# Altium schematic sheet main.SchDoc
size A2
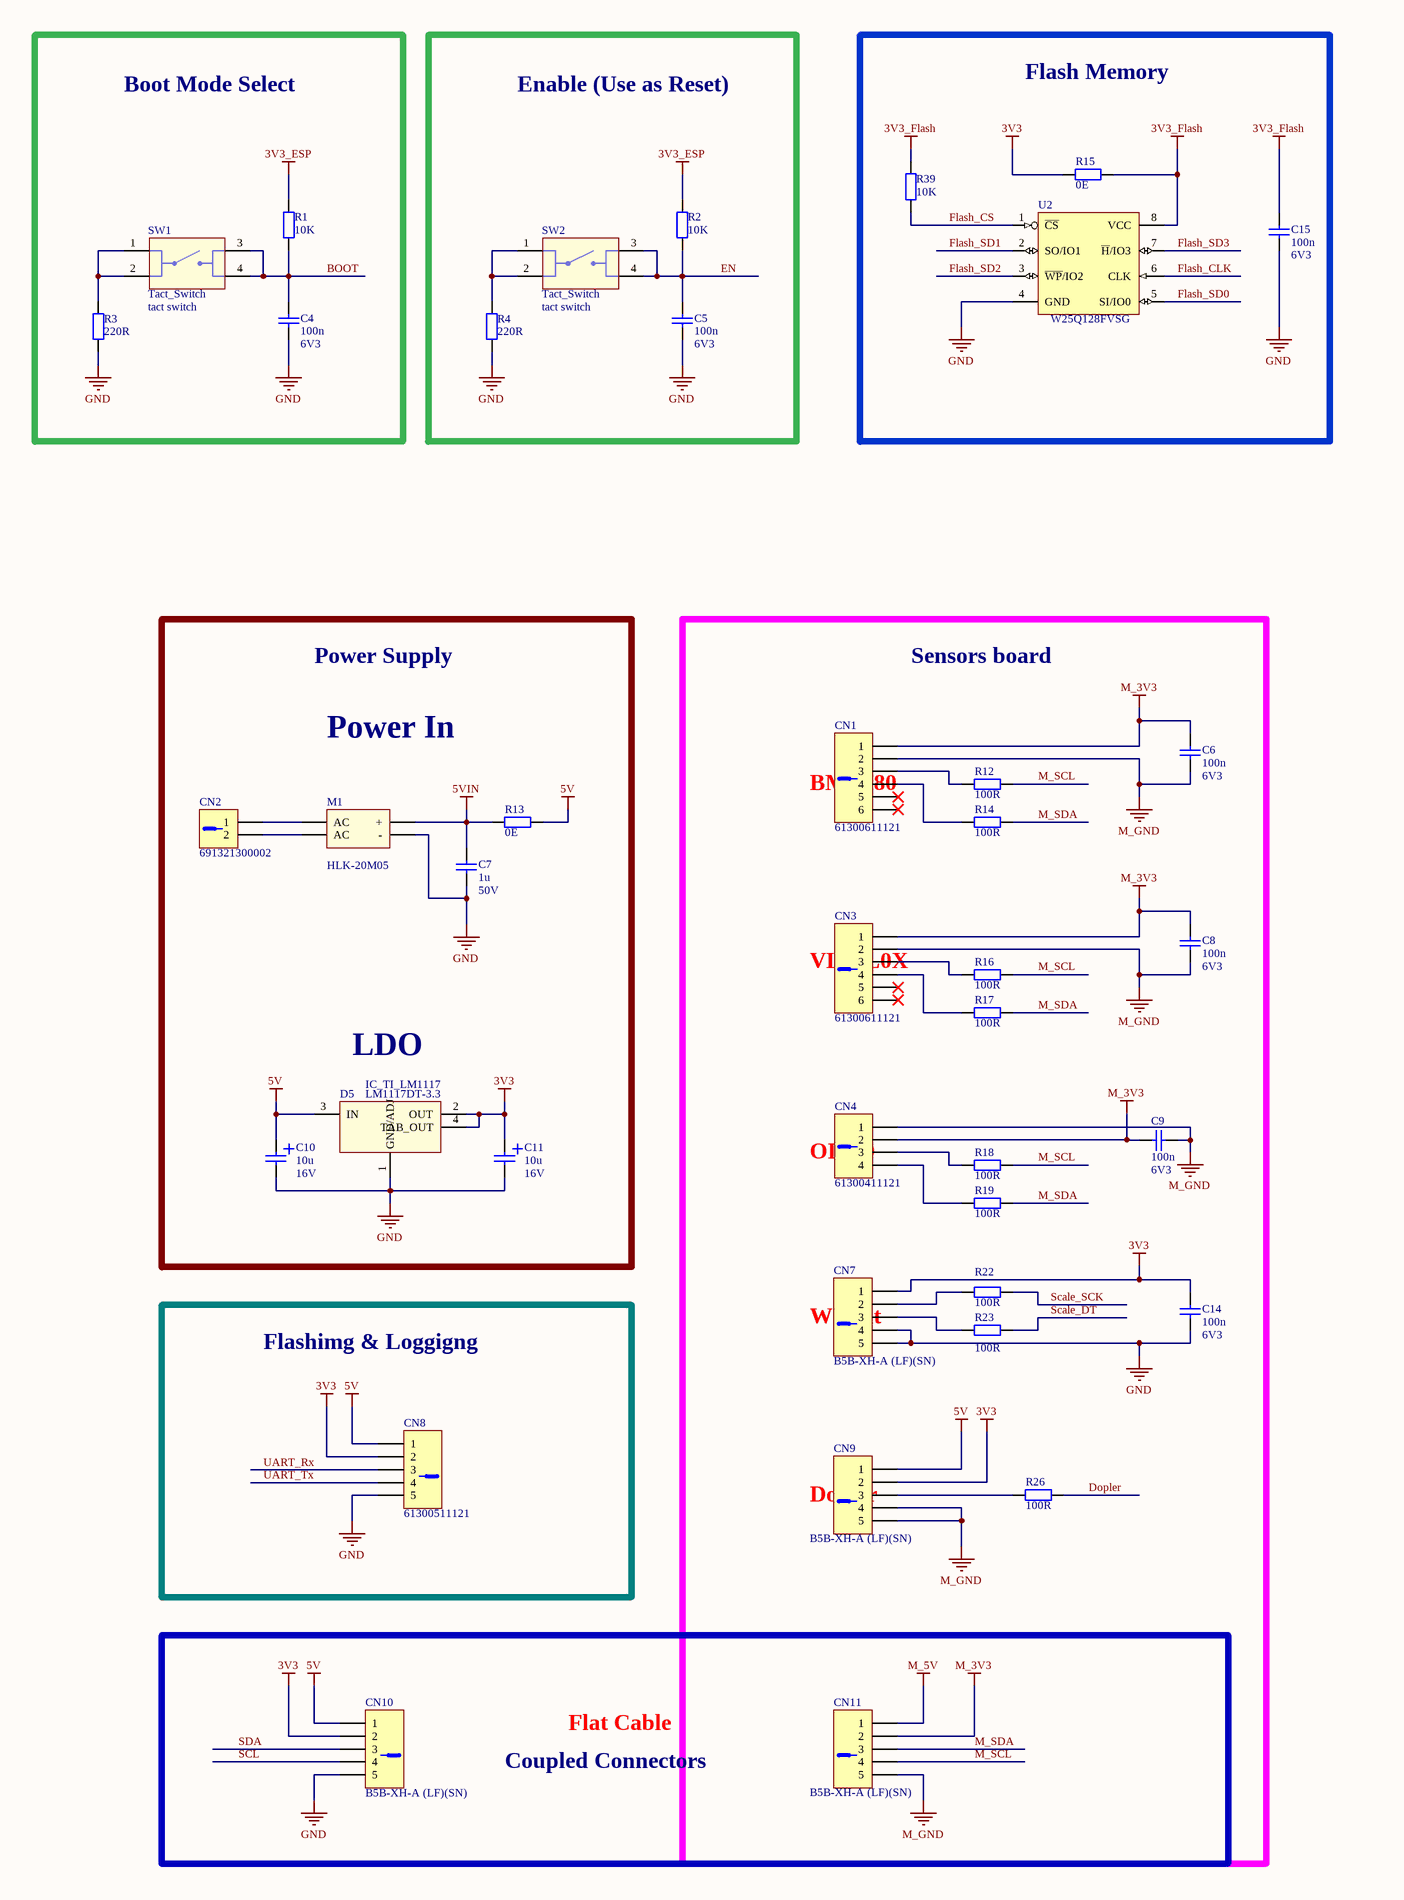
[diagram p0: main.SchDoc, left]
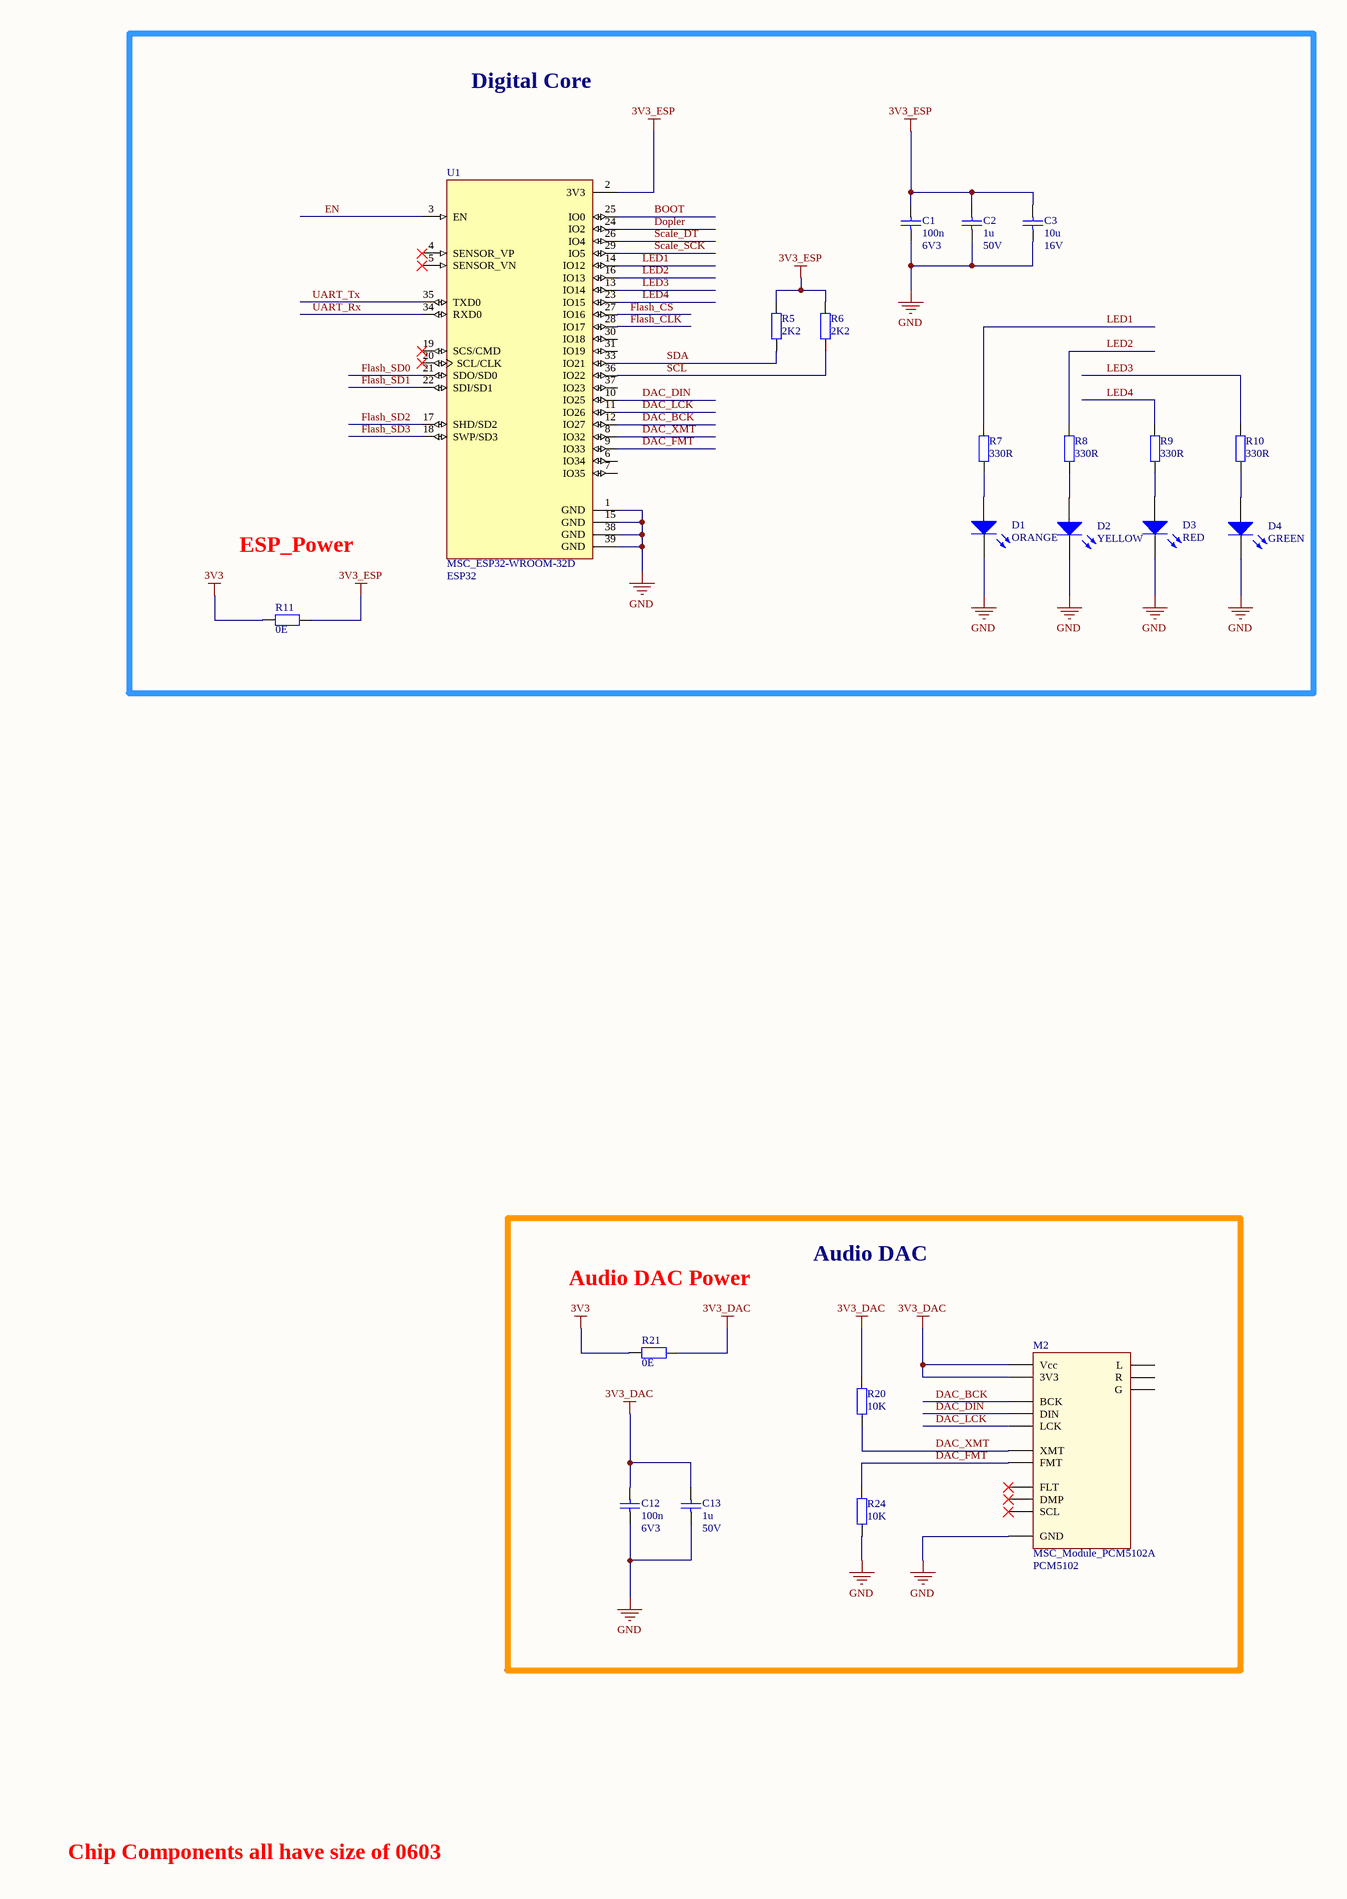
[diagram p1: main.SchDoc, right]

## Parts
C1  Value1: 100n  Value2: 6V3  [CAPC0603X31N]  (hidden comment: CAP)
C2  Value1: 1u  Value2: 50V  [CAPC2012X125N]  (hidden comment: CAP)
C3  Value1: 10u  Value2: 16V  [CAPC2012X145N]  (hidden comment: CAP)
C4  Value1: 100n  Value2: 6V3  [CAPC0603X31N]  (hidden comment: CAP)
C5  Value1: 100n  Value2: 6V3  [CAPC0603X31N]  (hidden comment: CAP)
C6  Value1: 100n  Value2: 6V3  [CAPC0603X31N]  (hidden comment: CAP)
C7  Value1: 1u  Value2: 50V  [CAPC2012X125N]  (hidden comment: CAP)
C8  Value1: 100n  Value2: 6V3  [CAPC0603X31N]  (hidden comment: CAP)
C9  Value1: 100n  Value2: 6V3  [CAPC0603X31N]  (hidden comment: CAP)
C10  Value1: 10u  Value2: 16V  [CAPAE430X550N]  (hidden comment: CAP_POL)
C11  Value1: 10u  Value2: 16V  [CAPAE430X550N]  (hidden comment: CAP_POL)
C12  Value1: 100n  Value2: 6V3  [CAPC0603X31N]  (hidden comment: CAP)
C13  Value1: 1u  Value2: 50V  [CAPC2012X125N]  (hidden comment: CAP)
C14  Value1: 100n  Value2: 6V3  [CAPC0603X31N]  (hidden comment: CAP)
C15  Value1: 100n  Value2: 6V3  [CAPC0603X31N]  (hidden comment: CAP)
CN1  Value1: 61300611121  [CN_WURTH_61300611121]  (hidden comment: CN_1X6M)
CN2  Value1: 691321300002  [CN_WURTH_691321300002]  (hidden comment: CN_1X2M)
CN3  Value1: 61300611121  [CN_WURTH_61300611121]  (hidden comment: CN_1X6M)
CN4  Value1: 61300411121  [CN_WURTH_61300411121]  (hidden comment: CN_1X4M)
CN7  Value1: B5B-XH-A (LF)(SN)  [CN_JST_B5B-XH-A]  (hidden comment: CN_1X5M)
CN8  Value1: 61300511121  [CN_Wurth_61300511121]  (hidden comment: CN_1X5M)
CN9  Value1: B5B-XH-A (LF)(SN)  [CN_JST_B5B-XH-A]  (hidden comment: CN_1X5M)
CN10  Value1: B5B-XH-A (LF)(SN)  [CN_JST_B5B-XH-A]  (hidden comment: CN_1X5M)
CN11  Value1: B5B-XH-A (LF)(SN)  [CN_JST_B5B-XH-A]  (hidden comment: CN_1X5M)
D1  Value1: ORANGE  [DIO_KINGBRIGHT_KP-1608S]  (hidden comment: DIO_LED)
D2  Value1: YELLOW  [DIO_KINGBRIGHT_KP-1608S]  (hidden comment: DIO_LED)
D3  Value1: RED  [DIO_KINGBRIGHT_KP-1608S]  (hidden comment: DIO_LED)
D4  Value1: GREEN  [DIO_KINGBRIGHT_KP-1608S]  (hidden comment: DIO_LED)
D5  IC_TI_LM1117  Value1: LM1117DT-3.3  [IC_TI_LM1117_TO252]
M1  Value1: HLK-20M05  [MSC_HiLink_HLK-20M05]  (hidden comment: MSC_HiLink_HLK-20M05)
M2  MSC_Module_PCM5102A  Value1: PCM5102  [MSC_Module_PCM5102A]
R1  Value1: 10K  [RESC0603X26N]  (hidden comment: RES)
R2  Value1: 10K  [RESC0603X26N]  (hidden comment: RES)
R3  Value1: 220R  [RESC0603X26N]  (hidden comment: RES)
R4  Value1: 220R  [RESC0603X26N]  (hidden comment: RES)
R5  Value1: 2K2  [RESC0603X26N]  (hidden comment: RES)
R6  Value1: 2K2  [RESC0603X26N]  (hidden comment: RES)
R7  Value1: 330R  [RESC0603X26N]  (hidden comment: RES)
R8  Value1: 330R  [RESC0603X26N]  (hidden comment: RES)
R9  Value1: 330R  [RESC0603X26N]  (hidden comment: RES)
R10  Value1: 330R  [RESC0603X26N]  (hidden comment: RES)
R11  Value1: 0E  [RESC0603X26N]  (hidden comment: RES)
R12  Value1: 100R  [RESC0603X26N]  (hidden comment: RES)
R13  Value1: 0E  [RESC0603X26N]  (hidden comment: RES)
R14  Value1: 100R  [RESC0603X26N]  (hidden comment: RES)
R15  Value1: 0E  [RESC0603X26N]  (hidden comment: RES)
R16  Value1: 100R  [RESC0603X26N]  (hidden comment: RES)
R17  Value1: 100R  [RESC0603X26N]  (hidden comment: RES)
R18  Value1: 100R  [RESC0603X26N]  (hidden comment: RES)
R19  Value1: 100R  [RESC0603X26N]  (hidden comment: RES)
R20  Value1: 10K  [RESC0603X26N]  (hidden comment: RES)
R21  Value1: 0E  [RESC0603X26N]  (hidden comment: RES)
R22  Value1: 100R  [RESC0603X26N]  (hidden comment: RES)
R23  Value1: 100R  [RESC0603X26N]  (hidden comment: RES)
R24  Value1: 10K  [RESC0603X26N]  (hidden comment: RES)
R26  Value1: 100R  [RESC0603X26N]  (hidden comment: RES)
R39  Value1: 10K  [RESC0603X26N]  (hidden comment: RES)
SW1  Tact_Switch  Value1: tact switch  [Tact_Switch_SMD]
SW2  Tact_Switch  Value1: tact switch  [Tact_Switch_SMD]
U1  MSC_ESP32-WROOM-32D  Value1: ESP32  [MSC_ESP32-WROOM-32D]
U2  Value1: W25Q128FVSG  [IC_Winbond_8pin_25]  (hidden comment: IC_Winbond_8pin_25)

## Blocks framed on the sheet
Boot Mode Select: C4 R1 R3 SW1
Enable (Use as Reset): C5 R2 R4 SW2
Flash Memory: C15 R15 R39 U2
Flashimg & Loggigng: CN8

## Nets
3V3: C11.1 C14.2 CN7.1 CN8.2 CN9.2 CN10.2 D5.2(OUT) D5.4(TAB_OUT) R11.1 R15.1 R21.1
3V3_DAC: C12.2 C13.2 M2.1(Vcc) M2.2(3V3) R20.2 R21.2
3V3_ESP: C1.2 C2.2 C3.2 R1.2 R2.2 R5.2 R6.2 R11.2 U1.2(3V3)
3V3_Flash: C15.2 R15.2 R39.2 U2.8(VCC)
5V: C10.1 CN8.1 CN9.1 CN10.1 D5.3(IN) R13.1
5VIN: C7.2 M1.3(+) R13.2
GND: C1.1 C2.1 C3.1 C4.1 C5.1 C7.1 C10.2 C11.2 C12.1 C13.1 C14.1 C15.1 CN7.4 CN7.5 CN8.5 CN10.5 D1.1(K) D2.1(K) D3.1(K) D4.1(K) D5.1(GND/ADJ) M1.4(-) M2.3(GND) R3.1 R4.1 R24.1 U1.1(GND) U1.15(GND) U1.38(GND) U1.39(GND) U2.4(GND)
M_3V3: C6.2 C8.2 C9.1 CN1.1 CN3.1 CN4.2 CN11.2
M_5V: CN11.1
M_GND: C6.1 C8.1 C9.2 CN1.2 CN3.2 CN4.1 CN9.4 CN9.5 CN11.5
BOOT: C4.2 R1.1 SW1.3 SW1.4 U1.25(IO0)
DAC_BCK: M2.7(BCK) U1.12(IO27)
DAC_DIN: M2.8(DIN) U1.10(IO25)
DAC_FMT: M2.10(FMT) R24.2 U1.9(IO33)
DAC_LCK: M2.9(LCK) U1.11(IO26)
DAC_XMT: M2.11(XMT) R20.1 U1.8(IO32)
Dopler: R26.2 U1.24(IO2)
EN: C5.2 R2.1 SW2.3 SW2.4 U1.3(EN)
Flash_CLK: U1.28(IO17) U2.6(CLK)
Flash_CS: R39.1 U1.27(IO16) U2.1(~{CS})
Flash_SD0: U1.21(SDO/SD0) U2.5(SI/IO0)
Flash_SD1: U1.22(SDI/SD1) U2.2(SO/IO1)
Flash_SD2: U1.17(SHD/SD2) U2.3(~{WP}/IO2)
Flash_SD3: U1.18(SWP/SD3) U2.7(~{H}/IO3)
LED1: R7.2 U1.14(IO12)
LED2: R8.2 U1.16(IO13)
LED3: R10.2 U1.13(IO14)
LED4: R9.2 U1.23(IO15)
M_SCL: CN11.4 R12.2 R16.2 R18.2
M_SDA: CN11.3 R14.2 R17.2 R19.2
Scale_DT: R23.2 U1.26(IO4)
Scale_SCK: R22.2 U1.29(IO5)
SCL: CN10.4 R6.1 U1.36(IO22)
SDA: CN10.3 R5.1 U1.33(IO21)
UART_Rx: CN8.3 U1.34(RXD0)
UART_Tx: CN8.4 U1.35(TXD0)
NetCN1_3: CN1.3 R12.1
NetCN1_4: CN1.4 R14.1
NetCN2_1: CN2.1 M1.1(AC)
NetCN2_2: CN2.2 M1.2(AC)
NetCN3_3: CN3.3 R16.1
NetCN3_4: CN3.4 R17.1
NetCN4_3: CN4.3 R18.1
NetCN4_4: CN4.4 R19.1
NetCN7_2: CN7.2 R22.1
NetCN7_3: CN7.3 R23.1
NetCN9_3: CN9.3 R26.1
NetD1_2: D1.2(A) R7.1
NetD2_2: D2.2(A) R8.1
NetD3_2: D3.2(A) R9.1
NetD4_2: D4.2(A) R10.1
NetR3_2: R3.2 SW1.1 SW1.2
NetR4_2: R4.2 SW2.1 SW2.2

Not connected (* = marked no-connect by the designer): CN1 5* 6*; CN3 5* 6*; M2 4(FLT)* 5(DMP)* 6(SCL)* 12(L) 13(G) 14(R); U1 4(SENSOR_VP)* 5(SENSOR_VN)* 6(IO34) 7(IO35) 19(SCS/CMD)* 20(SCL/CLK)* 30(IO18) 31(IO19) 37(IO23)

## Notes on the sheet
- Digital Core
- ESP_Power
- Power Supply
- Sensors board
- Power In
- BME280
- VL53L0X
- (near D5) LDO
- OLED
- Weight
- Audio DAC Power
- Audio DAC
- Dopler
- Flat Cable
- Coupled Connectors
- Chip Components all have size of 0603
- FILE:
- PDT:
- CLIENT
- REF.
- DRAWN
- ALTIUM VERSION:
- TITLE
- STATUS
- PROJECT REV.
- SHEET SUBVERSION REV.
- github.com/Sashkoiv/smart_table
- SHEET
- Version :

## Library data of the parts
C1 C4-C6 C8 C9 C12 C14 C15 = 01_01477: CAP, MLCC, X5R, 100NF, 6.3V, 02; Manufacturer: Murata; Manufacturer PN: GRM033R60J104KE19D; AutoId: 1477; DeviceType: capacitor; SubType: Ceramic; Id: 01_01477; Status: 0 - Unchecked; MountType: SMD; ComponentLink1URL: X:\01_dataSheets\CAP_MURATA_GRM033R60J10KE19X.pdf; Supplier 1: Farnell; Supplier Part Number 1: 1775994; ComponentLink1Description: Datasheet
C2 C7 C13 = 01_01396: X7R 10% 0805; Manufacturer: KEMET; Manufacturer PN: C0805C105K5RACTU; AutoId: 1396; DeviceType: capacitor; SubType: Ceramic; Id: 01_01396; Status: 2 - Checked and Approved; MountType: SMT; ComponentLink1URL: X:\01_Datasheets\CAP_KEMET_CxxxxCxxxXxRAC.pdf; Supplier 1: Farnell; Supplier Part Number 1: 2118131; ComponentLink1Description: Datasheet
C3 = 01_01524: Multilayer Ceramic Capacitors MLCC - SMD/SMT 10uF 16Volts X7R +/-20% 0805 STD; Manufacturer: Kemet; Manufacturer PN: EMK212BB7106MG-T; AutoId: 1524; Id: 01_01524; DeviceType: capacitor; SubType: Ceramic Capacitors; Status: 0 - Unchecked; MountType: SMT; ComponentLink1URL: X:\01_Datasheets\; Supplier 1: Mouser; Supplier Part Number 1: 963-EMK212BB7106MG-T; ComponentLink1Description: Datasheet
C10 C11 = 01_01399: ELCO 20%; Manufacturer: Nichicon; Manufacturer PN: UWF1C100MCL1GB; AutoId: 1399; DeviceType: capacitor; SubType: Electrolyte; Id: 01_01399; Status: 2 - Checked and Approved; MountType: SMT; ComponentLink1URL: X:\01_Datasheets\CAP_NICHICON_UWF1C100MCL1GB.pdf; Supplier 1: Farnell; Supplier Part Number 1: 647-UWF1C100MCL1GB; ComponentLink1Description: Datasheet
CN1 CN3 = 02_00118: WURTH ELEKTRONIK - 61300611121 - HEADER, 2.54MM, PIN, THT, VERTICAL, 6WAY; AutoId: 118; Value2: 6 pin male header; DeviceType: Connector_6; Id: 02_00118; Manufacturer: Wurth; Manufacturer PN: 61300611121; SubType: Header; Status: 2 - Checked and Approved; MountType: THT; ComponentLink1Description: Datasheet; ComponentLink1URL: X:\01_Datasheets\CN_WURTH_61300611121.pdf; ComponentLink2Description: ComponentVerificationSheet; ComponentLink2URL: X:\02_ComponentVerificationSheets\; Supplier 1: Farnell; Supplier Part Number 1: 2356158
CN2 = 02_00094: WURTH ELEKTRONIK - 691321300002 - HEADER, 3.81MM; AutoId: 94; Value2: 2 pin; DeviceType: Connector_2; Id: 02_00094; Manufacturer: Wurth; Manufacturer PN: 691321300002; Status: 0 - Unchecked; MountType: THT; ComponentLink1Description: Datasheet; ComponentLink1URL: X:\01_dataSheets\CN_WURTH_691320000x.pdf; ComponentLink2Description: ComponentVerificationSheet; ComponentLink2URL: X:\02_ComponentVerificationSheets\; Supplier 1: Farnell; Supplier Part Number 1: 1642006
CN4 = 02_00034: 4 pin male pin header, pitch 2.54mm; Manufacturer: Wurth Electronics; AutoId: 36; Value3: 4 pin; DeviceType: Connector_4; SubType: 1x4; Id: 02_00034; Manufacturer PN: 61300411121; Status: 2 - Checked and Approved; MountType: THT; ComponentLink1Description: Datasheet; ComponentLink1URL: X:\01_Datasheets\CN_WURTH_6130xx11121.pdf; ComponentLink2Description: ComponentVerificationSheet; ComponentLink2URL: X:\02_ComponentVerificationSheets\CN_WURTH_61300411121_ComponentVerificationSheet.xlsx; Supplier 1: Wurth; Supplier Part Number 1: 61300411121
CN7 CN9-CN11 = 02_10126: Through Hole Straight; Manufacturer: JST; AutoId: 166; Value2: 5 pin; Value3: 2.54mm; DeviceType: Connector_; Id: 02_10126; Manufacturer PN: B5B-XH-A (LF)(SN); Status: 0 - Unchecked; MountType: THT; ComponentLink1Description: Datasheet; ComponentLink1URL: X:\01_Datasheets\CN_JST_B5B-XH-A.pdf; ComponentLink2Description: ComponentVerificationSheet; ComponentLink2URL: X:\02_ComponentVerificationSheets\; Supplier 1: Farnell; Supplier Part Number 1: 1516281
CN8 = 02_00139: Headers & Wire Housings WR-PHD 2.54mm Hdr 5P Single Str Gold; Manufacturer: Wurth; AutoId: 139; Value2: 5 pin; Value3: header; DeviceType: Connector_; Id: 02_00139; Manufacturer PN: 61300511121; Status: 0 - Unchecked; MountType: THT; ComponentLink1Description: Datasheet; ComponentLink1URL: X:\01_Datasheets\CN_Wurth_61300511121.pdf; ComponentLink2Description: ComponentVerificationSheet; ComponentLink2URL: X:\02_ComponentVerificationSheets\; Supplier 1: Mouser; Supplier Part Number 1: 710-61300511121
D1 = 03_00011: Led orange; Manufacturer: KINGBRIGHT; Manufacturer PN: KP-1608SECK; AutoId: 11; DeviceType: diode; Id: 03_00011; SubType: LED; Status: 2 - Checked and Approved; MountType: SMT; ComponentLink1Description: Datasheet; ComponentLink1URL: X:\01_Datasheets\DIO_KINGBRIGHT_KP-1608SECK.pdf; ComponentLink2Description: ComponentVerificationSheet; ComponentLink2URL: X:\02_ComponentVerificationSheets\DIO_KINGBRIGHT_KP-1608SECK_ComponentVerificationSheet.xlsx; Supplier 1: Farnell; Supplier Part Number 1: 8529850
D2 = 03_00010: Led yellow; Manufacturer: KINGBRIGHT; Manufacturer PN: KP-1608SYC; AutoId: 10; DeviceType: diode; Id: 03_00010; SubType: LED; Status: 2 - Checked and Approved; MountType: SMT; ComponentLink1Description: Datasheet; ComponentLink1URL: X:\01_Datasheets\DIO_KINGBRIGHT_KP-1608SYC.pdf; ComponentLink2Description: ComponentVerificationSheet; ComponentLink2URL: X:\02_ComponentVerificationSheets\DIO_KINGBRIGHT_KP-1608SYC_ComponentVerificationSheet.xlsx; Supplier 1: Farnell; Supplier Part Number 1: 8529841
D3 = 03_00009: Led red; Manufacturer: KINGBRIGHT; Manufacturer PN: KP-1608SURC; AutoId: 9; DeviceType: diode; Id: 03_00009; SubType: LED; Status: 2 - Checked and Approved; MountType: SMT; ComponentLink1Description: Datasheet; ComponentLink1URL: X:\01_Datasheets\DIO_KINGBRIGHT_KP-1608SURC.pdf; ComponentLink2Description: ComponentVerificationSheet; ComponentLink2URL: X:\02_ComponentVerificationSheets\DIO_KINGBRIGHT_KP-1608SURC_ComponentVerificationSheet.xlsx; Supplier 1: Farnell; Supplier Part Number 1: 8529868
D4 = 03_00004: Led green; Manufacturer: KINGBRIGHT; Manufacturer PN: KP-1608SGC; AutoId: 4; DeviceType: diode; Id: 03_00004; SubType: LED; Status: 2 - Checked and Approved; MountType: SMD; ComponentLink1Description: Datasheet; ComponentLink1URL: X:\01_Datasheets\DIO_KINGBRIGHT_KP-1608SGC.pdf; ComponentLink2Description: ComponentVerificationSheet; ComponentLink2URL: X:\02_ComponentVerificationSheets\DIO_KINGBRIGHT_KP-1608SGC_ComponentVerificationSheet.xlsx; Supplier 1: Farnell; Supplier Part Number 1: 8529833
D5 = 07_10180: LDO Voltage Regulators 800MA LDO LINEAR REG; Manufacturer: TI; Manufacturer PN: LM1117DT-3.3/NOPB; AutoId: 289; Value2: 3V3 800mA; DeviceType: IC; Id: 07_10180; Status: 0 - Unchecked; MountType: SMT; ComponentLink1Description: Datasheet; ComponentLink1URL: X:\01_Datasheets\; ComponentLink2Description: ComponentVerificationSheet; ComponentLink2URL: X:\02_ComponentVerificationSheets\
M1 = 12_00136: Power Supply; Manufacturer: HiLink; AutoId: 147; Value2: 5V 4A; Value3: 20W; DeviceType: misc; Id: 12_00136; Manufacturer PN: HLK-20M05; Status: 0 - Unchecked; MountType: THD; ComponentLink1Description: Datasheet; ComponentLink1URL: X:\01_Datasheets\; ComponentLink2Description: ComponentVerificationSheet; ComponentLink2URL: X:\02_ComponentVerificationSheets\
M2 = 12_00137: Audio DAC I2S; AutoId: 148; DeviceType: misc; Id: 12_00137; Status: 0 - Unchecked; MountType: THD; ComponentLink1Description: Datasheet; ComponentLink1URL: X:\01_Datasheets\; ComponentLink2Description: ComponentVerificationSheet; ComponentLink2URL: X:\02_ComponentVerificationSheets\
R1 R2 R20 R24 R39 = 15_00122: RESISTOR, 0201, 10K, 1%, SMD; Manufacturer: Yageo; Manufacturer PN: RC0201FR-0710K; AutoId: 122; Value2: 0W05; SubType: Metal film; Id: 15_00122; DeviceType: resistor; Status: 0 - Unchecked; MountType: SMT; ComponentLink1Description: Datasheet; ComponentLink1URL: X:\01_Datasheets\RES_YAGEO_RC0201FR.pdf; Supplier 1: Farnell
R3 R4 = 15_00102: RESISTOR, 0201, 220R, 1%, SMD; Manufacturer: Yageo; Manufacturer PN: RC0201FR-07220R; AutoId: 102; Value2: 0W05; SubType: Metal film; Id: 15_00102; DeviceType: resistor; Status: 0 - Unchecked; MountType: SMT; ComponentLink1Description: Datasheet; ComponentLink1URL: X:\01_Datasheets\RES_YAGEO_RC0201FR.pdf; Supplier 1: Farnell
R5 R6 = 15_00114: RESISTOR, 0201, 2K2, 1%, SMD; Manufacturer: Yageo; Manufacturer PN: RC0201FR-072K2; AutoId: 114; Value2: 0W05; SubType: Metal film; Id: 15_00114; DeviceType: resistor; Status: 0 - Unchecked; MountType: SMT; ComponentLink1Description: Datasheet; ComponentLink1URL: X:\01_Datasheets\RES_YAGEO_RC0201FR.pdf; Supplier 1: Farnell
R7-R10 = 15_00104: RESISTOR, 0201, 330R, 1%, SMD; Manufacturer: Yageo; Manufacturer PN: RC0201FR-07330R; AutoId: 104; Value2: 0W05; SubType: Metal film; Id: 15_00104; DeviceType: resistor; Status: 0 - Unchecked; MountType: SMT; ComponentLink1Description: Datasheet; ComponentLink1URL: X:\01_Datasheets\RES_YAGEO_RC0201FR.pdf; Supplier 1: Farnell
R11 R13 R15 R21 = 15_00608: Thick Film Resistors - SMD ZERO OHM JUMPER; Manufacturer: Yageo; Manufacturer PN: RC0201JR-070RL; AutoId: 608; Id: 15_00608; Footprint4: n/a; Value2: n/a; DeviceType: resistor; Status: 0 - Unchecked; MountType: SMT; ComponentLink1Description: Datasheet; ComponentLink1URL: X:\01_Datasheets\RES_Yageo_RC0201JR-070RL.pdf; Supplier 1: Mouser; Supplier Part Number 1: 603-RC0201JR-070RL
R12 R14 R16-R19 R22 R23 R26 = 15_00098: RESISTOR, 0201, 100R, 1%, SMD; Manufacturer: Yageo; Manufacturer PN: RC0201FR-07100R; AutoId: 98; Value2: 0W05; SubType: Metal film; Id: 15_00098; DeviceType: resistor; Status: 0 - Unchecked; MountType: SMT; ComponentLink1Description: Datasheet; ComponentLink1URL: X:\01_Datasheets\RES_YAGEO_RC0201FR.pdf; Supplier 1: Farnell
SW1 SW2 = 12_00117: AutoId: 117; DeviceType: misc; Id: 12_00117; Status: 0 - Unchecked; ComponentLink1Description: Datasheet; ComponentLink1URL: X:\01_Datasheets\; ComponentLink2Description: ComponentVerificationSheet; ComponentLink2URL: X:\02_ComponentVerificationSheets\
U1 = 12_10065: Bluetooth, WiFi 802.11b/g/n, Bluetooth v4.2 + EDR, Class 1, 2 and 3 Transceiver Module 2.4GHz ~ 2.5GHz Integrated, Trace Surface Mount; Manufacturer: Espressif; AutoId: 143; Value2: WROOM; DeviceType: misc; Id: 12_10065; Manufacturer PN: ESP32; Status: 0 - Unchecked; MountType: SMT; ComponentLink1Description: Datasheet; ComponentLink1URL: X:\01_Datasheets\; ComponentLink2Description: ComponentVerificationSheet; ComponentLink2URL: X:\02_ComponentVerificationSheets\
U2 = 07_00283: IC FLASH 128M SPI 104MHZ 8SOIC; Manufacturer: Winbond Electronics; Manufacturer PN: W25Q128FVSIG; AutoId: 290; Value3: 128M 104MHz; SubType: NOR; Id: 07_00283; Value2: Flash 128M; DeviceType: Flash; Status: 0 - Unchecked; MountType: SMT; ComponentLink1Description: Datasheet; ComponentLink1URL: X:\01_Datasheets\IC_Winbond_W25Q128FV.pdf; ComponentLink2Description: ComponentVerificationSheet; ComponentLink2URL: X:\02_ComponentVerificationSheets\; Supplier 1: Digi-Key; Supplier Part Number 1: W25Q128FVSIG-ND